# Altium schematic sheet Headstage_Bottom_Plate.SchDoc: Headstage - Bottom Plate (Shield)
size A3; DrawnBy: Bruno Almeida; DocumentNumber: 1; SheetNumber: 1; SheetTotal: 1
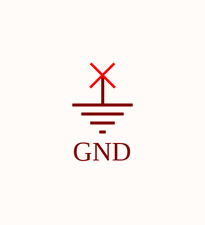
[diagram p0: Headstage_Bottom_Plate.SchDoc]

## Notes on the sheet
- Labels drawn without touching a wire or pin: GND